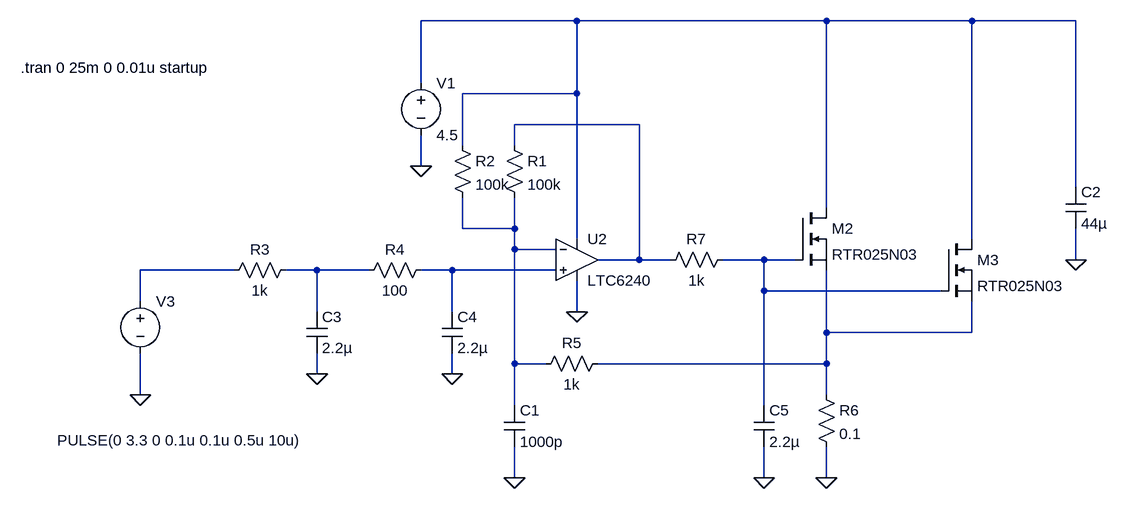
[diagram p0: schematic E-Load.asc]
E-Load.asc, the LTspice schematic file:
Version 4
SHEET 1 2296 680
WIRE 1472 -144 1232 -144
WIRE 1856 -144 1472 -144
WIRE 2080 -144 1856 -144
WIRE 2240 -144 2080 -144
WIRE 1232 -48 1232 -144
WIRE 1472 -32 1472 -144
WIRE 1472 -32 1296 -32
WIRE 1568 16 1376 16
WIRE 1296 48 1296 -32
WIRE 1376 48 1376 16
WIRE 1232 80 1232 32
WIRE 2240 112 2240 -144
WIRE 1856 144 1856 -144
WIRE 1296 176 1296 128
WIRE 1376 176 1376 128
WIRE 1376 176 1296 176
WIRE 1472 192 1472 -32
WIRE 2080 192 2080 -144
WIRE 1376 208 1376 176
WIRE 1440 208 1376 208
WIRE 1568 224 1568 16
WIRE 1568 224 1504 224
WIRE 1616 224 1568 224
WIRE 1760 224 1696 224
WIRE 1808 224 1760 224
WIRE 2240 224 2240 176
WIRE 944 240 800 240
WIRE 1072 240 1024 240
WIRE 1152 240 1072 240
WIRE 1280 240 1232 240
WIRE 1440 240 1280 240
WIRE 1760 272 1760 224
WIRE 2032 272 1760 272
WIRE 800 288 800 240
WIRE 1072 304 1072 240
WIRE 1280 304 1280 240
WIRE 1472 304 1472 256
WIRE 1856 336 1856 240
WIRE 2080 336 2080 288
WIRE 2080 336 1856 336
WIRE 1376 384 1376 208
WIRE 1424 384 1376 384
WIRE 1856 384 1856 336
WIRE 1856 384 1504 384
WIRE 1072 400 1072 368
WIRE 1280 400 1280 368
WIRE 800 432 800 368
WIRE 1856 432 1856 384
WIRE 1376 448 1376 384
WIRE 1760 448 1760 272
WIRE 1376 560 1376 512
WIRE 1760 560 1760 512
WIRE 1856 560 1856 512
FLAG 1232 80 0
FLAG 800 432 0
FLAG 1472 304 0
FLAG 1856 560 0
FLAG 2240 224 0
FLAG 1072 400 0
FLAG 1280 400 0
FLAG 1760 560 0
FLAG 1376 560 0
SYMBOL voltage 1232 -64 R0
WINDOW 123 0 0 Left 2
WINDOW 39 0 0 Left 2
SYMATTR InstName V1
SYMATTR Value 4.5
SYMBOL voltage 800 272 R0
WINDOW 123 0 0 Left 2
WINDOW 39 0 0 Left 2
WINDOW 3 -128 230 Left 2
SYMATTR Value PULSE(0 3.3 0 0.1u 0.1u 0.5u 10u)
SYMATTR InstName V3
SYMBOL Opamps\\LTC6240 1472 224 R0
SYMATTR InstName U2
SYMBOL res 1040 224 R90
WINDOW 0 0 56 VBottom 2
WINDOW 3 32 56 VTop 2
SYMATTR InstName R3
SYMATTR Value 1k
SYMBOL res 1248 224 R90
WINDOW 0 0 56 VBottom 2
WINDOW 3 32 56 VTop 2
SYMATTR InstName R4
SYMATTR Value 100
SYMBOL res 1520 368 R90
WINDOW 0 0 56 VBottom 2
WINDOW 3 32 56 VTop 2
SYMATTR InstName R5
SYMATTR Value 1k
SYMBOL res 1840 416 R0
SYMATTR InstName R6
SYMATTR Value 0.1
SYMBOL res 1712 208 R90
WINDOW 0 0 56 VBottom 2
WINDOW 3 32 56 VTop 2
SYMATTR InstName R7
SYMATTR Value 1k
SYMBOL nmos 1808 144 R0
SYMATTR InstName M2
SYMATTR Value RTR025N03
SYMBOL cap 2224 112 R0
SYMATTR InstName C2
SYMATTR Value 44µ
SYMATTR SpiceLine Rser=0.015
SYMBOL cap 1056 304 R0
SYMATTR InstName C3
SYMATTR Value 2.2µ
SYMBOL cap 1264 304 R0
SYMATTR InstName C4
SYMATTR Value 2.2µ
SYMBOL nmos 2032 192 R0
SYMATTR InstName M3
SYMATTR Value RTR025N03
SYMBOL cap 1744 448 R0
SYMATTR InstName C5
SYMATTR Value 2.2µ
SYMBOL res 1360 32 R0
SYMATTR InstName R1
SYMATTR Value 100k
SYMBOL cap 1360 448 R0
SYMATTR InstName C1
SYMATTR Value 1000p
SYMBOL res 1280 32 R0
SYMATTR InstName R2
SYMATTR Value 100k
TEXT 616 -72 Left 2 !.tran 0 25m 0 0.01u startup

The netlist it stands for:
* E-Load.asc
V1 N001 0 4.5
V3 N005 0 PULSE(0 3.3 0 0.1u 0.1u 0.5u 10u)
* U2: LTC6240 (symbol Opamps\LTC6240 not available, pins judged from their places): In+=N007 In-=N003 V+=N001 V-=0 OUT=N002
R3 N006 N005 1k
R4 N007 N006 100
R5 N008 N003 1k
R6 N008 0 0.1
R7 N004 N002 1k
M2 N001 N004 N008 N008 RTR025N03
C2 N001 0 44µ Rser=0.015
C3 N006 0 2.2µ
C4 N007 0 2.2µ
M3 N001 N004 N008 N008 RTR025N03
C5 N004 0 2.2µ
R1 N002 N003 100k
C1 N003 0 1000p
R2 N001 N003 100k
.model NMOS NMOS
.model PMOS PMOS
.lib standard.mos
.tran 0 25m 0 0.01u startup
.backanno
.end